# EAGLE schematic Kramek (EAGLE 9.3.0)
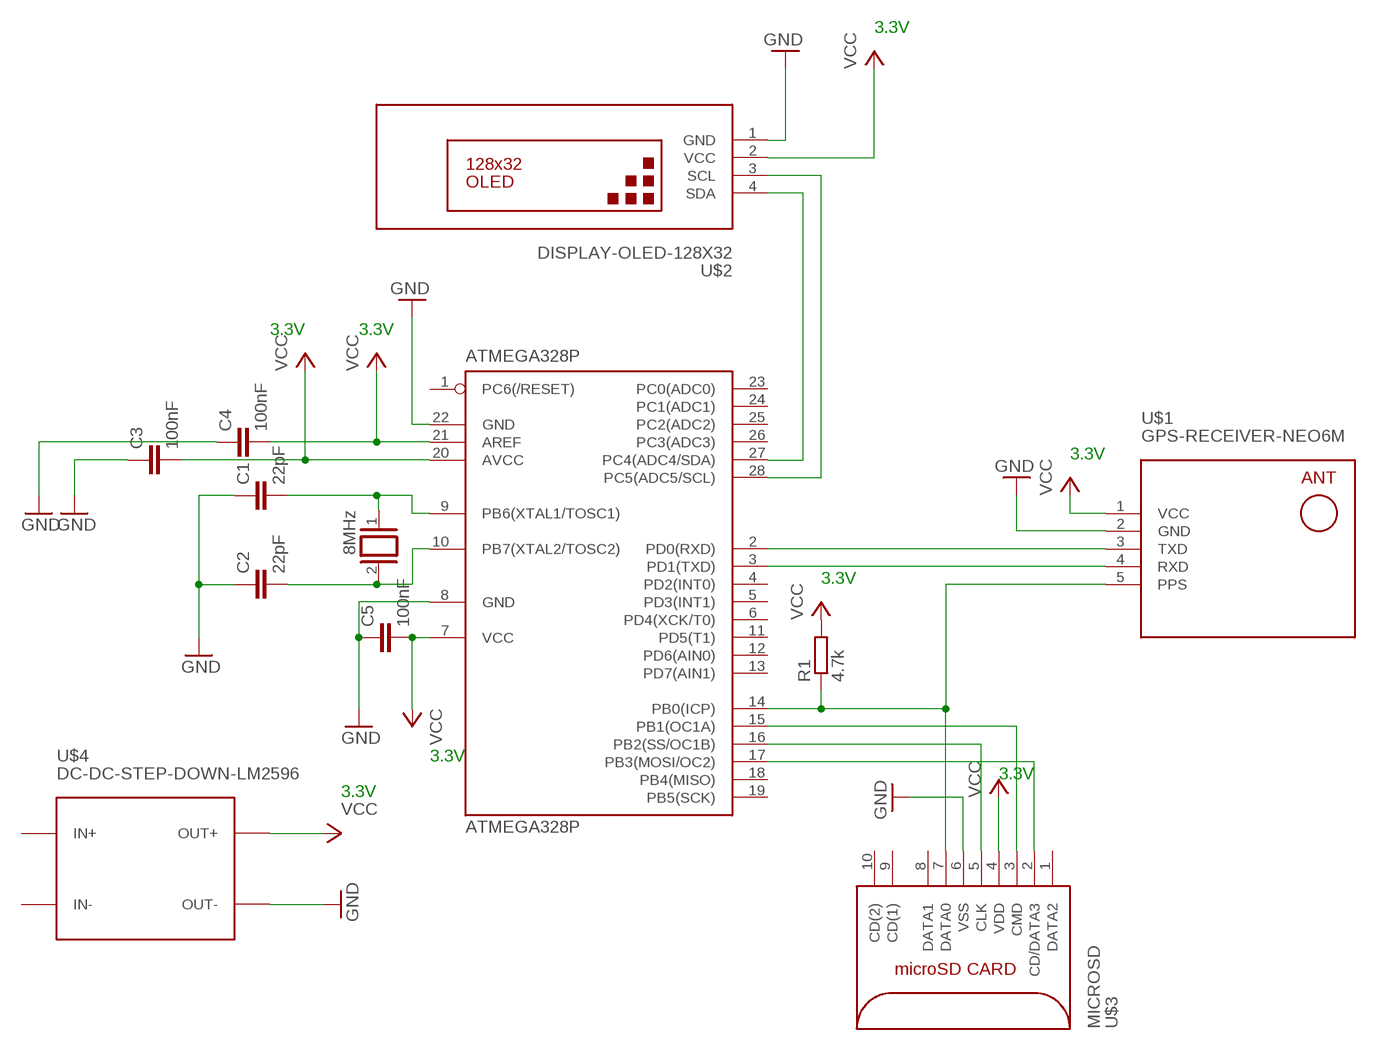
[diagram p0: schematic, sheet 1]

## Parts
ATMEGA328P  ATMEGA328P  MEGA8-P  [DIL28-3]
C1  22pF  C2,5-3  [C2.5-3]
C2  22pF  C2,5-3  [C2.5-3]
C3  100nF  C2,5-3  [C2.5-3]
C4  100nF  C2,5-3  [C2.5-3]
C5  100nF  C2,5-3  [C2.5-3]
Q1  8MHz  XTAL  [Q]
R1  4.7k  R-EU_0204/2V  [0204V]
U$1  GPS-RECEIVER-NEO6M  [GPS-RECEIVER-NEO6M]
U$2  DISPLAY-OLED-128X32  [DISPLAY-OLED-128X32]
U$3  MICROSD  MICROSD_SD_MODE  [MICRO_SD_CONNECTOR]
U$4  DC-DC-STEP-DOWN-LM2596  [DC-DC-STEP-DOWN-LM2596]

## Nets
GND: ATMEGA328P.8(GND) ATMEGA328P.22(GND) C1.1 C2.1 C5.1 U$1.2(GND) U$2.1(GND) U$3.6(VSS) U$4.OUT-
N$1: ATMEGA328P.2(PD0(RXD)) U$1.3(TXD)
N$2: ATMEGA328P.3(PD1(TXD)) U$1.4(RXD)
N$4: ATMEGA328P.14(PB0(ICP)) R1.1 U$1.5(PPS) U$3.7(DATA0)
N$5: ATMEGA328P.15(PB1(OC1A)) U$3.3(CMD)
N$6: ATMEGA328P.16(PB2(SS/OC1B)) U$3.5(CLK)
N$7: ATMEGA328P.17(PB3(MOSI/OC2)) U$3.2(CD/DATA3)
N$8: ATMEGA328P.27(PC4(ADC4/SDA)) U$2.4(SDA)
N$9: ATMEGA328P.28(PC5(ADC5/SCL)) U$2.3(SCL)
N$10: C4.1 ; supply symbol labelled GND
N$11: C3.1 ; supply symbol labelled GND
N$13: ATMEGA328P.9(PB6(XTAL1/TOSC1)) C1.2 Q1.1
N$14: ATMEGA328P.10(PB7(XTAL2/TOSC2)) C2.2 Q1.2
VCC: ATMEGA328P.7(VCC) ATMEGA328P.20(AVCC) ATMEGA328P.21(AREF) C3.2 C4.2 C5.2 R1.2 U$1.1(VCC) U$2.2(VCC) U$3.4(VDD) U$4.OUT+
Unconnected: ATMEGA328P.1(PC6(/RESET)) ATMEGA328P.4(PD2(INT0)) ATMEGA328P.5(PD3(INT1)) ATMEGA328P.6(PD4(XCK/T0)) ATMEGA328P.11(PD5(T1)) ATMEGA328P.12(PD6(AIN0)) ATMEGA328P.13(PD7(AIN1)) ATMEGA328P.18(PB4(MISO)) ATMEGA328P.19(PB5(SCK)) ATMEGA328P.23(PC0(ADC0)) ATMEGA328P.24(PC1(ADC1)) ATMEGA328P.25(PC2(ADC2)) ATMEGA328P.26(PC3(ADC3)) U$3.1(DATA2) U$3.8(DATA1) U$3.9(CD(1)) U$3.10(CD(2)) U$4.IN+ U$4.IN-

## Notes on the sheet
- 3.3V
- 3.3V | 3.3V
- 3.3V
- 3.3V
- 3.3V
- 3.3V
- 3.3V

## Library data of the parts
ATMEGA328P = atmel:MEGA8-P: MICROCONTROLLER 8 Kbytes FLASH, 1 kbytes SRAM, 512 bytes EEPROM, USART, 4-channel 10 bit ADC, 2-channel 8 bit ADC Pin compatible with Atmega48, ATMega88, ATMega168 Source: avr.lbr; OC_FARNELL: unknown; OC_NEWARK: unknown
C1-C5 = capacitor-wima:C: CAPACITOR naming: grid - package width
Q1 = special:XTAL: CRYSTAL
R1 = rcl:R-EU_: RESISTOR, European symbol; SPICEPREFIX: R
U$1 = diy-modules:GPS-RECEIVER-NEO6M: GPS Receiver Module based on NEO-6 device Short tutorial how to use NEO-6 module with Arduino: http://www.xarg.org/2016/06/neo6mv2-gps-module-with-arduino/ NEO-6 datasheet is available here: https://www.u-blox.com/sites/default/files/products/documents/NEO-6_DataSheet_%28GPS.G6-HW-09005%29.pdf Click here to find device on ebay.com <http://www.ebay.com/sch/gyneo6mv2>
U$2 = diy-modules (8):DISPLAY-OLED-128X32: 128x32 Dot Matrix OLED Module with I2C interface based on SSD1306 chip More details available here: http://www.tinyosshop.com/index.php?route=product/product&product_id=953 Schematic available here: http://www.tinyosshop.com/datasheet/OLED%2012832.pdf SSD1306 datasheet: https://cdn-shop.adafruit.com/datasheets/SSD1306.pdf Click here to find device on ebay.com <http://www.ebay.com/sch/oled+display+128x32+i2c>
U$3 = con-molex-microsd:MICROSD_SD_MODE: MOLEX - 49225-0821 - CONNECTEUR MICRO SD PUSH/PUSH REV Fabricant: MOLEX Code commande Farnell: 1366700 <http://fr.farnell.com/molex/49225-0821/connecteur-micro-sd-push-push-rev/dp/1366700?Ntt=1366700> Référence fabricant: 49225-0821
U$4 = diy-modules:DC-DC-STEP-DOWN-LM2596: DC/DC Step-Down Regulator based on LM2596-ADJ chip LM2596 datasheet available here: http://www.ti.com/lit/ds/symlink/lm2596.pdf Click here to find device on ebay.com <http://www.ebay.com/sch/lm2596+power+regulator>